# EAGLE schematic Schematic v2 (EAGLE 9.7.0)
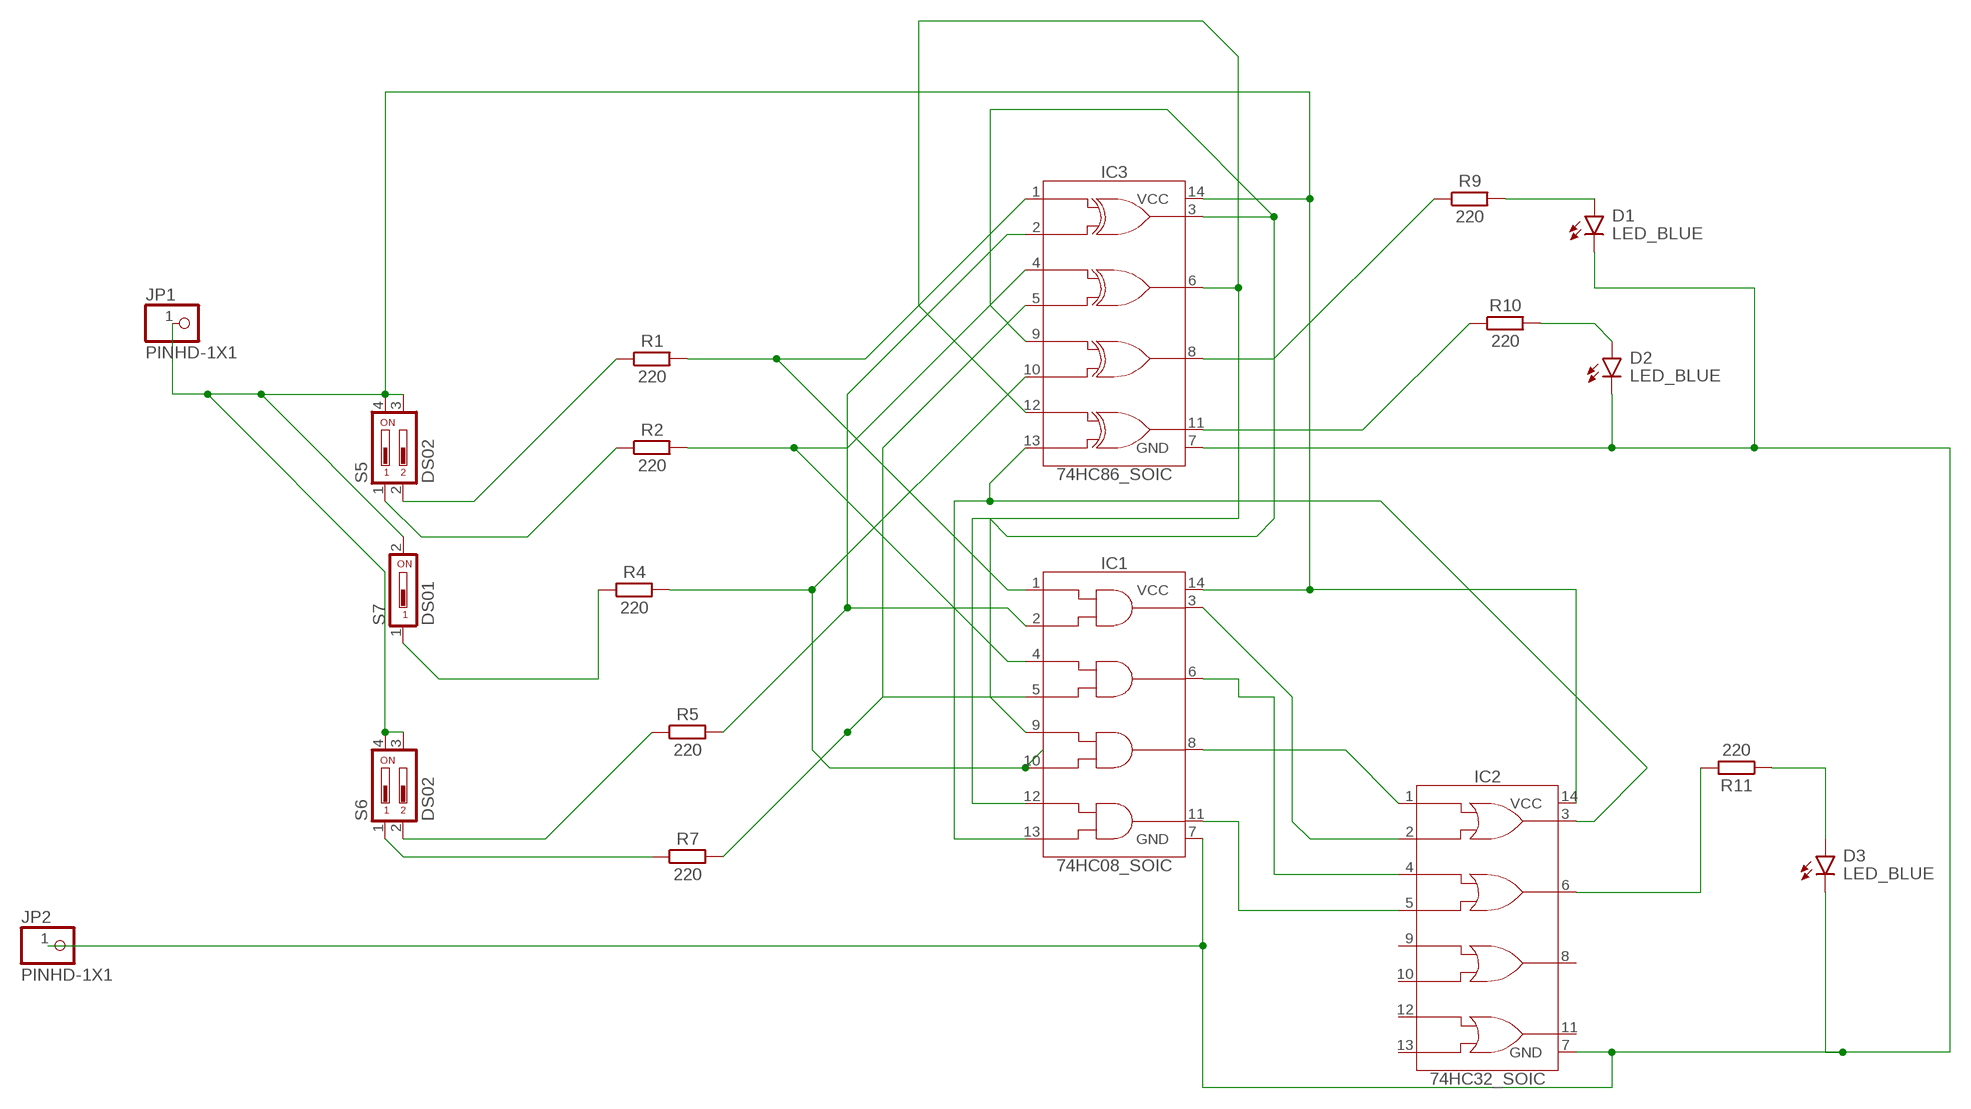
[diagram p0: schematic, sheet 1]

## Parts
D1  LED_BLUE  CHIP-FLAT-B_0402  [LEDC1005X25N_FLAT-B]
D2  LED_BLUE  CHIP-FLAT-B_0402  [LEDC1005X25N_FLAT-B]
D3  LED_BLUE  CHIP-FLAT-B_0402  [LEDC1005X25N_FLAT-B]
IC1  74HC08_SOIC  [SOIC127P600X175-14N]
IC2  74HC32_SOIC  [SOIC127P600X175-14N]
IC3  74HC86_SOIC  [SOIC127P600X175-14N]
JP1  PINHD-1X1  [1X01]
JP2  PINHD-1X1  [1X01]
R1  220  R_AXIAL-7.2MM-PITCH  [RESAD724W46L381D178B]
R2  220  R_AXIAL-7.2MM-PITCH  [RESAD724W46L381D178B]
R4  220  R_AXIAL-7.2MM-PITCH  [RESAD724W46L381D178B]
R5  220  R_AXIAL-7.2MM-PITCH  [RESAD724W46L381D178B]
R7  220  R_AXIAL-7.2MM-PITCH  [RESAD724W46L381D178B]
R9  220  R_AXIAL-7.2MM-PITCH  [RESAD724W46L381D178B]
R10  220  R_AXIAL-7.2MM-PITCH  [RESAD724W46L381D178B]
R11  220  R_AXIAL-7.2MM-PITCH  [RESAD724W46L381D178B]
S5  DS02  [DS-02]
S6  DS02  [DS-02]
S7  DS01  [DS-01]

## Nets
N$1: R1.1 S5.2
N$2: IC1.14(VCC) IC2.14(VCC) IC3.14(VCC) JP1.1 S5.3 S5.4 S6.3 S6.4 S7.2
N$3: R2.1 S5.1
N$4: R4.1 S7.1
N$5: R5.1 S6.2
N$6: R7.1 S6.1
N$7: IC1.1(1A) IC3.1(1A) R1.2
N$8: IC1.2(1B) IC3.2(1B) R5.2
N$9: IC1.4(2A) IC3.4(2A) R2.2
N$10: IC1.5(2B) IC3.5(2B) R7.2
N$11: IC1.10(3B) IC3.10(3B) R4.2
N$12: IC1.9(3A) IC3.3(1Y) IC3.9(3A)
N$13: IC3.8(3Y) R9.1
N$14: IC1.8(3Y) IC2.1(1A)
N$15: D1.A R9.2
N$16: IC1.3(1Y) IC2.2(1B)
N$17: IC1.13(4B) IC2.3(1Y) IC3.13(4B)
N$18: IC1.12(4A) IC3.6(2Y) IC3.12(4A)
N$19: IC3.11(4Y) R10.1
N$20: D2.A R10.2
N$21: IC1.11(4Y) IC2.5(2B)
N$22: IC1.6(2Y) IC2.4(2A)
N$24: IC2.6(2Y) R11.2
N$25: D3.A R11.1
N$27: D1.C D2.C D3.C IC1.7(GND) IC2.7(GND) IC3.7(GND) JP2.1
Unconnected: IC2.8(3Y) IC2.9(3A) IC2.10(3B) IC2.11(4Y) IC2.12(4A) IC2.13(4B)

## Library data of the parts
D1-D3 = LED:CHIP-FLAT-B; CATEGORY: LED; COLOR: BLUE; DESCRIPTION: CHIP LED FLAT; SUB-CATEGORY: CHIP; TYPE: FLAT_TOP
IC1 = IC_Logic:74HC08: Quadruple 2-Input AND Gates Reference Datasheet <https://www.ti.com/lit/ds/symlink/sn74hc08.pdf?ts=1637607755453&ref_url=https%253A%252F%252Fwww.google.com%252F>; CATEGORY: IC_Logic; DESCRIPTION: Quadruple 2-Input AND Gates; MANUFACTURER: Generic; MPN: Generic; SUB-CATEGORY: GATE; TYPE: AND
IC2 = IC_Logic:74HC32: Quadruple 2-Input OR Gates Reference Datasheet <https://www.ti.com/lit/ds/symlink/sn54hc32-sp.pdf?ts=1637578080525&ref_url=https%253A%252F%252Fwww.google.com%252F>; CATEGORY: IC_Logic; DESCRIPTION: Quadruple 2-Input OR Gates; MANUFACTURER: Generic; MPN: Generic; SUB-CATEGORY: GATE; TYPE: OR
IC3 = IC_Logic:74HC86: Quadruple 2-Input XOR Gates Reference Datasheet <https://www.ti.com/lit/ds/symlink/sn74hc86.pdf?ts=1637598937585&ref_url=https%253A%252F%252Fwww.google.com%252F>; CATEGORY: IC_Logic; DESCRIPTION: Quadruple 2-Input XOR; MANUFACTURER: Generic; MPN: Generic; SUB-CATEGORY: GATE; TYPE: XOR
JP1 JP2 = Connector:PINHD-1X1: PIN HEADER; CATEGORY: CONNECTOR; SUB-CATEGORY: PIN-HEADER
R1 R2 R4 R5 R7 R9-R11 = Resistor:R: Resistor Fixed - Generic; CATEGORY: Resistor; SUB-CATEGORY: Fixed
S5 S6 = Switch:DS02: DIL/CODE SWITCH; CATEGORY: SWITCH; MPN: MCNDS02; TYPE: SPST
S7 = Switch:DS01: DIL/CODE SWITCH; CATEGORY: SWITCH; TYPE: SPST